# EAGLE design wm_1 (EAGLE 9.3.0)
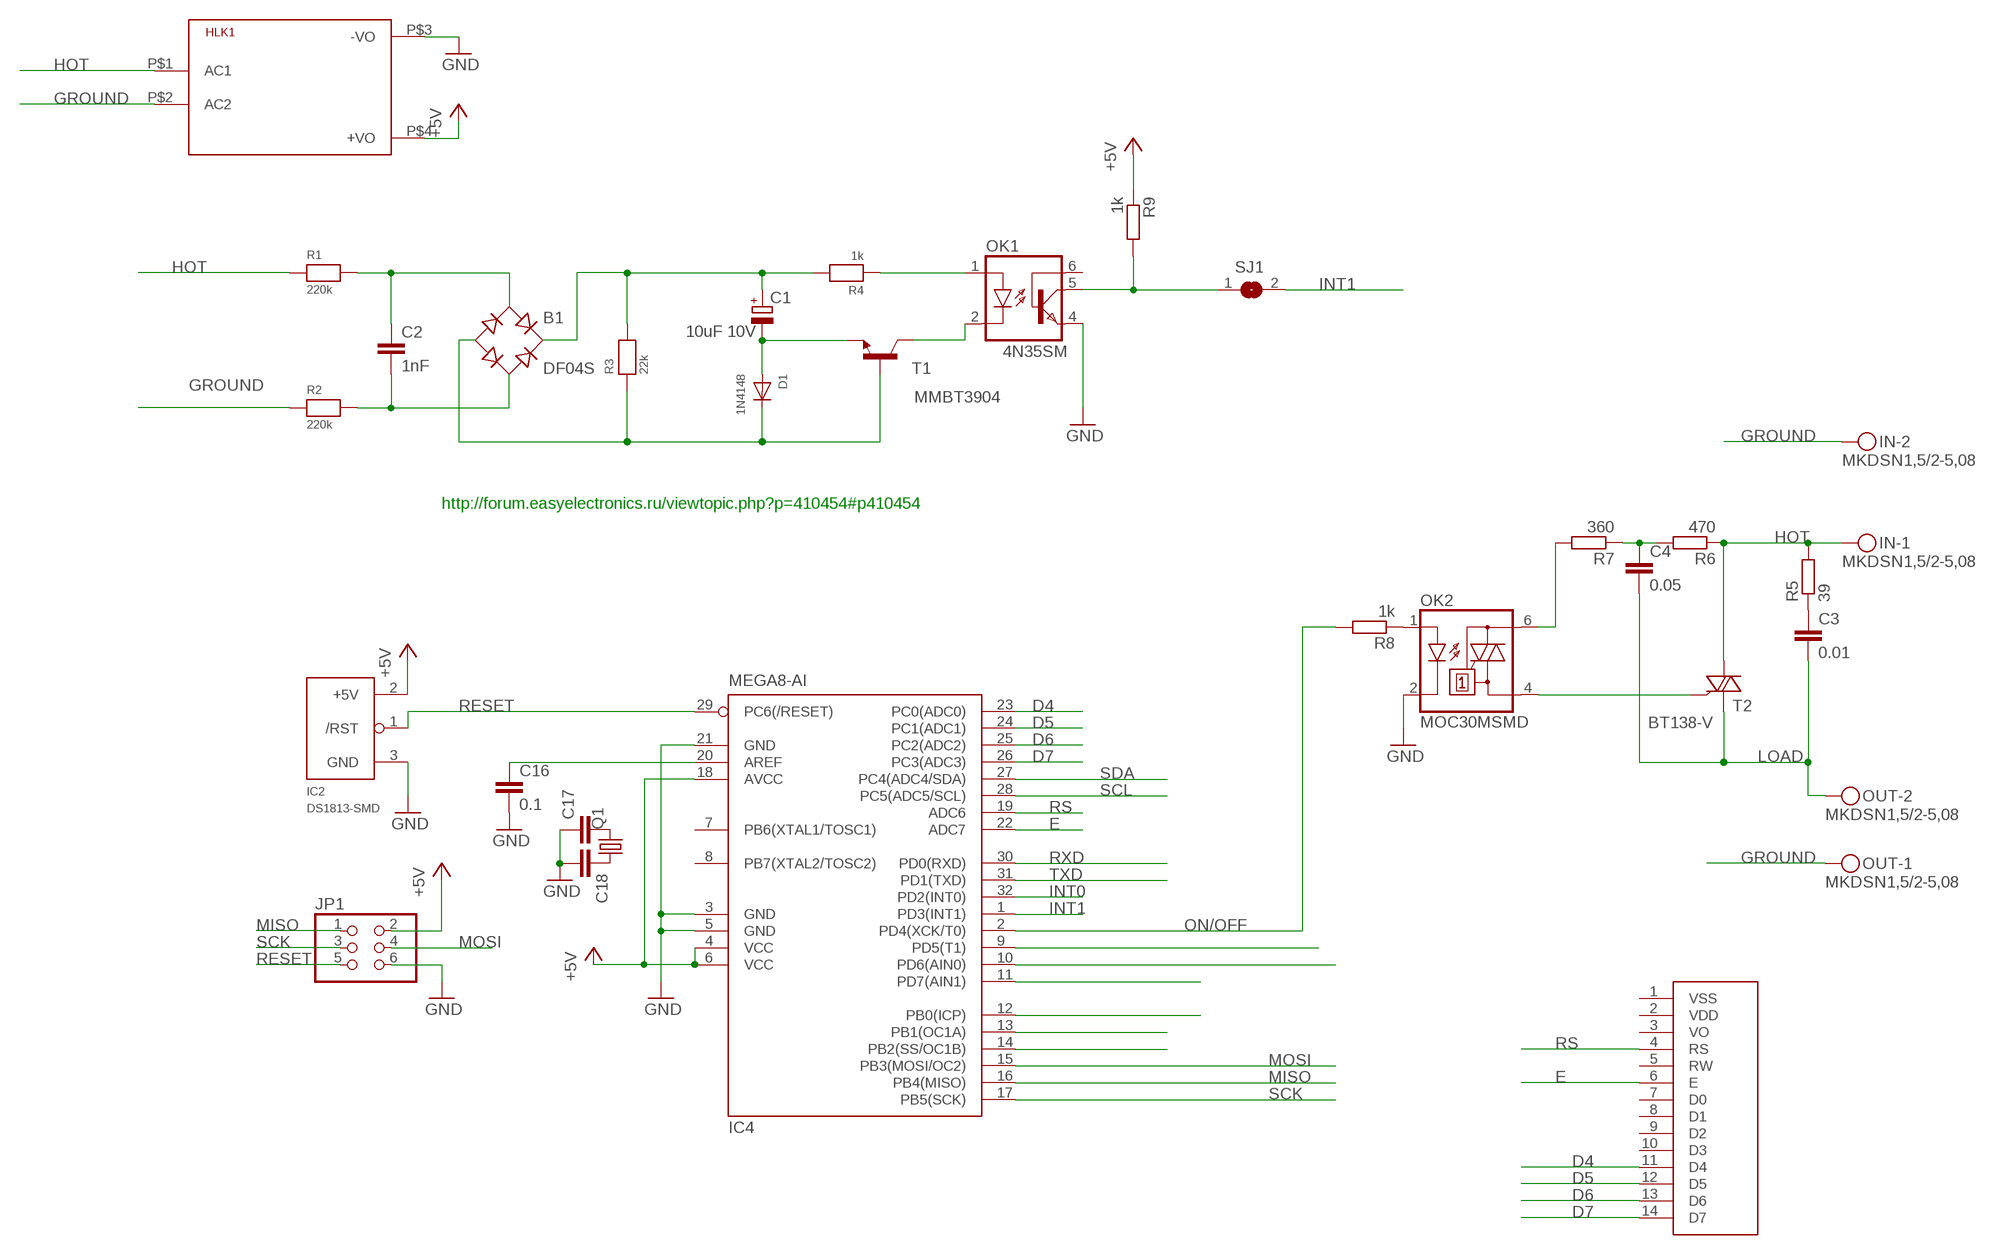
[diagram p0: schematic, sheet 1]

## Parts
B1  DF04S  [DFS]
C1  10uF 10V  CPOL-EU140CLH-1010  [140CLH-1010]
C2  1nF  C-EUC0805  [C0805]
C3  0.01  C-EUC1206  [C1206]
C4  0.05  C-EUC1206  [C1206]
C16  0.1  C-EUC0805  [C0805]
C17  C-EUC0805  [C0805]
C18  C-EUC0805  [C0805]
D1  1N4148  DIODESOD-123  [SOD-123]
HLK1  HLK-PM013W  [HLK-PM01]
IC2  DS1813-SMD  [SOT-23]
IC4  MEGA8-AI  [TQFP32-08]
IN  MKDSN1,5/2-5,08  [MKDSN1,5/2-5,08]
JP1  PINHD-2X3  [2X03]
OK1  4N35SM  [DIL6-SMD]
OK2  MOC30MSMD  [DIL6-SMD]
OUT  MKDSN1,5/2-5,08  [MKDSN1,5/2-5,08]
Q1  CRYSTALSM49  [SM49]
R1  220k  RESISTOR1206  [1206]
R2  220k  RESISTOR1206  [1206]
R3  22k  RESISTOR1206  [1206]
R4  1k  RESISTOR1206  [1206]
R5  39  R-EU_R1206  [R1206]
R6  470  R-EU_R1206  [R1206]
R7  360  R-EU_R1206  [R1206]
R8  1k  R-EU_R1206  [R1206]
R9  1k  R-EU_R1206  [R1206]
SJ1  SOLDERJUMPERREFLOW  [SOLDERJUMPER_REFLOW]
T1  MMBT3904  MMBT3904LT1-NPN-SOT23-BEC  [SOT23-BEC]
T2  BT138-V  [TO220BV]
U$1  2X16LCDSIDE  [2X16LCDSIDE]

## Nets
+5V: HLK1.P$4(+VO) IC2.2(+5V) IC4.4(VCC) IC4.6(VCC) IC4.18(AVCC) JP1.2 R9.1
D4: IC4.23(PC0(ADC0)) U$1.11(D4)
D5: IC4.24(PC1(ADC1)) U$1.12(D5)
D6: IC4.25(PC2(ADC2)) U$1.13(D6)
D7: IC4.26(PC3(ADC3)) U$1.14(D7)
E: IC4.22(ADC7) U$1.6(E)
E_RESET: IC4.13(PB1(OC1A))
E_SELECT: IC4.14(PB2(SS/OC1B))
GND: C16.2 C17.1 C18.2 HLK1.P$3(-VO) IC2.3(GND) IC4.3(GND) IC4.5(GND) IC4.21(GND) JP1.6 OK1.4(EMI) OK2.2(C)
GROUND: HLK1.P$2(AC2) IN.2 OUT.1 R2.1
HOT: HLK1.P$1(AC1) IN.1 R1.1 R5.2 R6.1 T2.T2(A2)
INT0: IC4.32(PD2(INT0))
INT1: IC4.1(PD3(INT1)) SJ1.2
LOAD: C3.2 C4.2 OUT.2 T2.T1(A1)
MISO: IC4.16(PB4(MISO)) JP1.1
MOSI: IC4.15(PB3(MOSI/OC2)) JP1.4
N$1: B1.AC1 C2.1 R1.2
N$2: B1.AC2 C2.2 R2.2
N$3: C1.- D1.A T1.E
N$4: B1.- D1.C R3.1 T1.B
N$5: B1.+ C1.+ R3.2 R4.2
N$6: OK1.1(A) R4.1
N$7: OK1.2(C) T1.C
N$8: C4.1 R6.2 R7.1
N$9: OK2.4(A1) T2.G
N$14: C18.1 Q1.1
N$15: C3.1 R5.1
N$16: OK2.6(A2) R7.2
N$17: OK2.1(A) R8.1
N$18: OK1.5(COL) R9.2 SJ1.1
N$26: C17.2 Q1.2
N$61: C16.1 IC4.20(AREF)
N$64: IC4.10(PD6(AIN0))
N$66: IC4.9(PD5(T1))
ON/OFF: IC4.2(PD4(XCK/T0)) R8.2
RESET: IC2.1(/RST) IC4.29(PC6(/RESET)) JP1.5
RS: IC4.19(ADC6) U$1.4(RS)
RXD: IC4.30(PD0(RXD))
SCK: IC4.17(PB5(SCK)) JP1.3
SCL: IC4.28(PC5(ADC5/SCL))
SD_DETECT: IC4.11(PD7(AIN1))
SD_SELECT: IC4.12(PB0(ICP))
SDA: IC4.27(PC4(ADC4/SDA))
TXD: IC4.31(PD1(TXD))
Unconnected: IC4.7(PB6(XTAL1/TOSC1)) IC4.8(PB7(XTAL2/TOSC2)) OK1.6(BAS) U$1.1(VSS) U$1.2(VDD) U$1.3(VO) U$1.5(RW) U$1.7(D0) U$1.8(D1) U$1.9(D2) U$1.10(D3)

## Notes on the sheet
- http://forum.easyelectronics.ru/viewtopic.php?p=410454#p410454

## Library data of the parts
B1 = rectifier:DF*S: Surface Mount Glass Passivated Bridge Rectifiers Source: Source: Comchip Bridge Rectifiers DF005S-G thru DF10S-G.pdf
C1 = rcl:CPOL-EU: POLARIZED CAPACITOR, European symbol; SPICEPREFIX: C
C2-C4 = rcl:C-EU: CAPACITOR, European symbol; SPICEPREFIX: C
C16-C18 = rcl:C-EU: CAPACITOR, European symbol
D1 = microbuilder:DIODE: Diode SMA Model Volts Amps Type Vf Vr Digikey # Notes SSA34-E3 40V 3A Schottky 480mV @ 3A 200uA @ 40V SSA34-E3/61TGITR-ND CDBA120-G 20V 1A Schottky 500mV @ 1A 500uA @ 20V 641-1014-6-ND REEL MBRA210 10V 2A Schottky 350mV @ 2A 700uA @ 10V MBRA210LT3 SOD-123 Model Volts Amps Type Vf Vr Order # Notes BAT54T1G 30V 200mA Schottky 800mV @ 200mA 2uA @ 25V BAT54T1GOSTR-ND B0530W 30V 500mA Schottky 430mV @ 500mA 130uA @ 30V B0530W-FDICT-ND REEL MBR120 1A 20V Schottky 340mV @ 1A MBR120VLSFT1GOSCT-ND SOD-323 Model Volts Amps Type Vf Vr Order # Notes PMEG2005EJ 20V 500mA Schottky 355mV @ 500mA 568-4110-1-ND ZLLS410 10V 570mA Schottky 380mV @ 570mA ZLLS410CT-ND 1N4148WS 75V 150mA Silicon/Simple 1V 1N4148WSFSCT-ND REEL SOD-523 Model Volts Amps Type Vf Vr Order # Notes BAT54XV2 30V 200mA Schottky 0.8V @ 100mA BAT54XV2CT-ND TB751S 30V 30mA Schottky RB751S-40TE61CT-ND SOT23-R/W (R = Solder Paste/Reflow Ovens, W = Hand-Soldering) Model Volts Amps Type Vf Vr Order # Notes BAT54FILM 40V 300mA Schottky 497-7162-1-ND
HLK1 = hi-link:HLK-PM01: Hi-Link Power Supply HLK-PM01 3W Author: Ahmed Said <https://github.com/AhmedSaid/EAGLELibraries>
IC2 = MyLib:DS1813
IC4 = atmel:MEGA8: MICROCONTROLLER 8 Kbytes FLASH, 1 kbytes SRAM, 512 bytes EEPROM, USART, 6-channel 10 bit ADC, 2-channel 8 bit ADC Pin compatible with Atmega48, ATMega88, ATMega168 Source: avr.lbr; MPN: ATMEGA8-16AU; OC_FARNELL: 9171371; OC_NEWARK: 73M8863
IN OUT = con-phoenix-508:MKDSN1,5/2-5,08: MKDSN 1,5/ 2-5,08 Printklemme Nennstrom: 13,5 A Nennspannung: 250 V Rastermaß: 5,08 mm Polzahl: 2 Anschlussart: Schraubanschluss Montage: Löten Anschlussrichtung Leiter/Platine: 0 ° Artikelnummer: 1729128 Source: http://eshop.phoenixcontact.com .. 1729128.pdf
JP1 = pinhead:PINHD-2X3: PIN HEADER
OK1 = optocoupler:4N*?M: General Purpose 6-Pin Phototransistor Optocouplers Source: http://www.fairchildsemi.com/ds/4N/4N35-M.pdf; MF: FAIRCHILD SEMICONDUCTOR; MPN: 4N35S-M; OC_FARNELL: 1021179; OC_NEWARK: 67K2285
OK2 = MyLib:MOC30*M: RANDOM-PHASE OPTOISOLATORS TRIAC DRIVER OUTPUT Source: http://www.fairchildsemi.com MOC3020-M.pdf
Q1 = crystal:CRYSTAL: CRYSTAL; OC_FARNELL: unknown; OC_NEWARK: unknown
R1-R4 = microbuilder:RESISTOR: Resistors 0402 - 0402 Surface Mount Package 22 Ohm 1% 1/16W [Digikey: 311-22.0LRTR-ND] 33 Ohm 5% 1/16W 1.0K 5% 1/16W 1.5K 5% 1/16W 2.0K 1% 1/16W 10.0K 1% 1/16W [Digikey: 311-10.0KLRTR-ND] 10.0K 5% 1/16W [Digikey: RMCF0402JT10K0TR-ND] 12.1K 1% 1/16W [Digikey: 311-22.0LRTR-ND] 100.0K 5% 1/16W 0603 - 0603 Surface Mount Package 0 Ohm 1/10 Watt 1% Resistor 15 Ohm 1/10 Watt 1% Resistor 33 Ohm 1/10 Watt 1% Resistor 49.9 Ohm 1/10 Watt 1% Resistor 100 Ohm 1/10 Watt 1% Resistor 150 Ohm 1/10 Watt 1% Resistor 240 Ohm 1/10 Watt 1% Resistor 390 Ohm 1/10 Watt 1% Resistor 560 Ohm 1/10 Watt 1% Resistor 680 Ohm 1/10 Watt 1% Resistor 750 Ohm 1/10 Watt 1% Resistor 1.0K Ohm 1/10 Watt 1% Resistor 1.5K Ohm 1/10 Watt 1% Resistor 2.0K Ohm 1/10 Watt 1% Resistor 2.2K Ohm 1/10 Watt 1% Resistor 3.3K Ohm 1/10 Watt 1% Resistor 4.7K Ohm 1/10 Watt 1% Resistor 10.0K Ohm 1/10 Watt 1% Resistor 12.0K Ohm 1/10 Watt 1% Resistor 12.1K Ohm 1/10 Watt 1% Resistor 20.0K Ohm 1/10 Watt 1% Resistor 33.0K Ohm 1/10 Watt 1% Resistor 100.0K Ohm 1/10 Watt 1% Resistor 0805 - 0805 Surface Mount Package 0 Ohm 1/8 Watt 1% Resistor 33 Ohm 1/8 Watt 1% Resistor 100 Ohm 1/8 Watt 1% Resistor 150 Ohm 1/8 Watt 1% Resistor 200 Ohm 1/8 Watt 1% Resistor 240 Ohm 1/8 Watt 1% Resistor 330 Ohm 1/8 Watt 1% Resistor 390 Ohm 1/8 Watt 1% Resistor 470 Ohm 1/8 Watt 1% Resistor 1.0K Ohm 1/8 Watt 1% Resistor 1.5K Ohm 1/8 Watt 1% Resistor 2.0K Ohm 1/8 Watt 1% Resistor 4.7K Ohm 1/8 Watt 1% Resistor 5.1K Ohm 1/8 Watt 1% Resistor 5.6K Ohm 1/8 Watt 1% Resistor 10.0K Ohm 1/8 Watt 1% Resistor 22.0K Ohm 1/8 Watt 1% Resistor 33.0K Ohm 1/8 Watt 1% Resistor 100K Ohm 1/8 Watt 1% Resistor 1206 - 1206 Surface Mount Package 2012 - 2010 Surface Mount Package 0.11 Ohm 1/2 Watt 1% Resistor - Digikey: RHM.11UCT-ND
R5-R9 = rcl:R-EU_: RESISTOR, European symbol; SPICEPREFIX: R
SJ1 = MyLib:SOLDERJUMPER: SMD Solder JUMPER Solder the two pads together to create a connection, or remove the solder to break it. REFLOW - Use this footprint for solder paste and reflow ovens. WAVE - Use this footprint for hand-soldering (larger pads). CLOSED - Has a trace between the two pads to ensure it is closed by default. The trace needs to be cut to disable the jumper, and can be closed again by creating a solder bridge between the two pads.
T1 = transistor:*-NPN-: NPN Transistror BF959 corrected 2008.03.06
T2 = MyLib:BT138: TRIAC Source: http://www.semiconductors.philips.com BT138_SERIES_2.pdf
U$1 = MyDisplays:2X16LCDSIDE

## Board
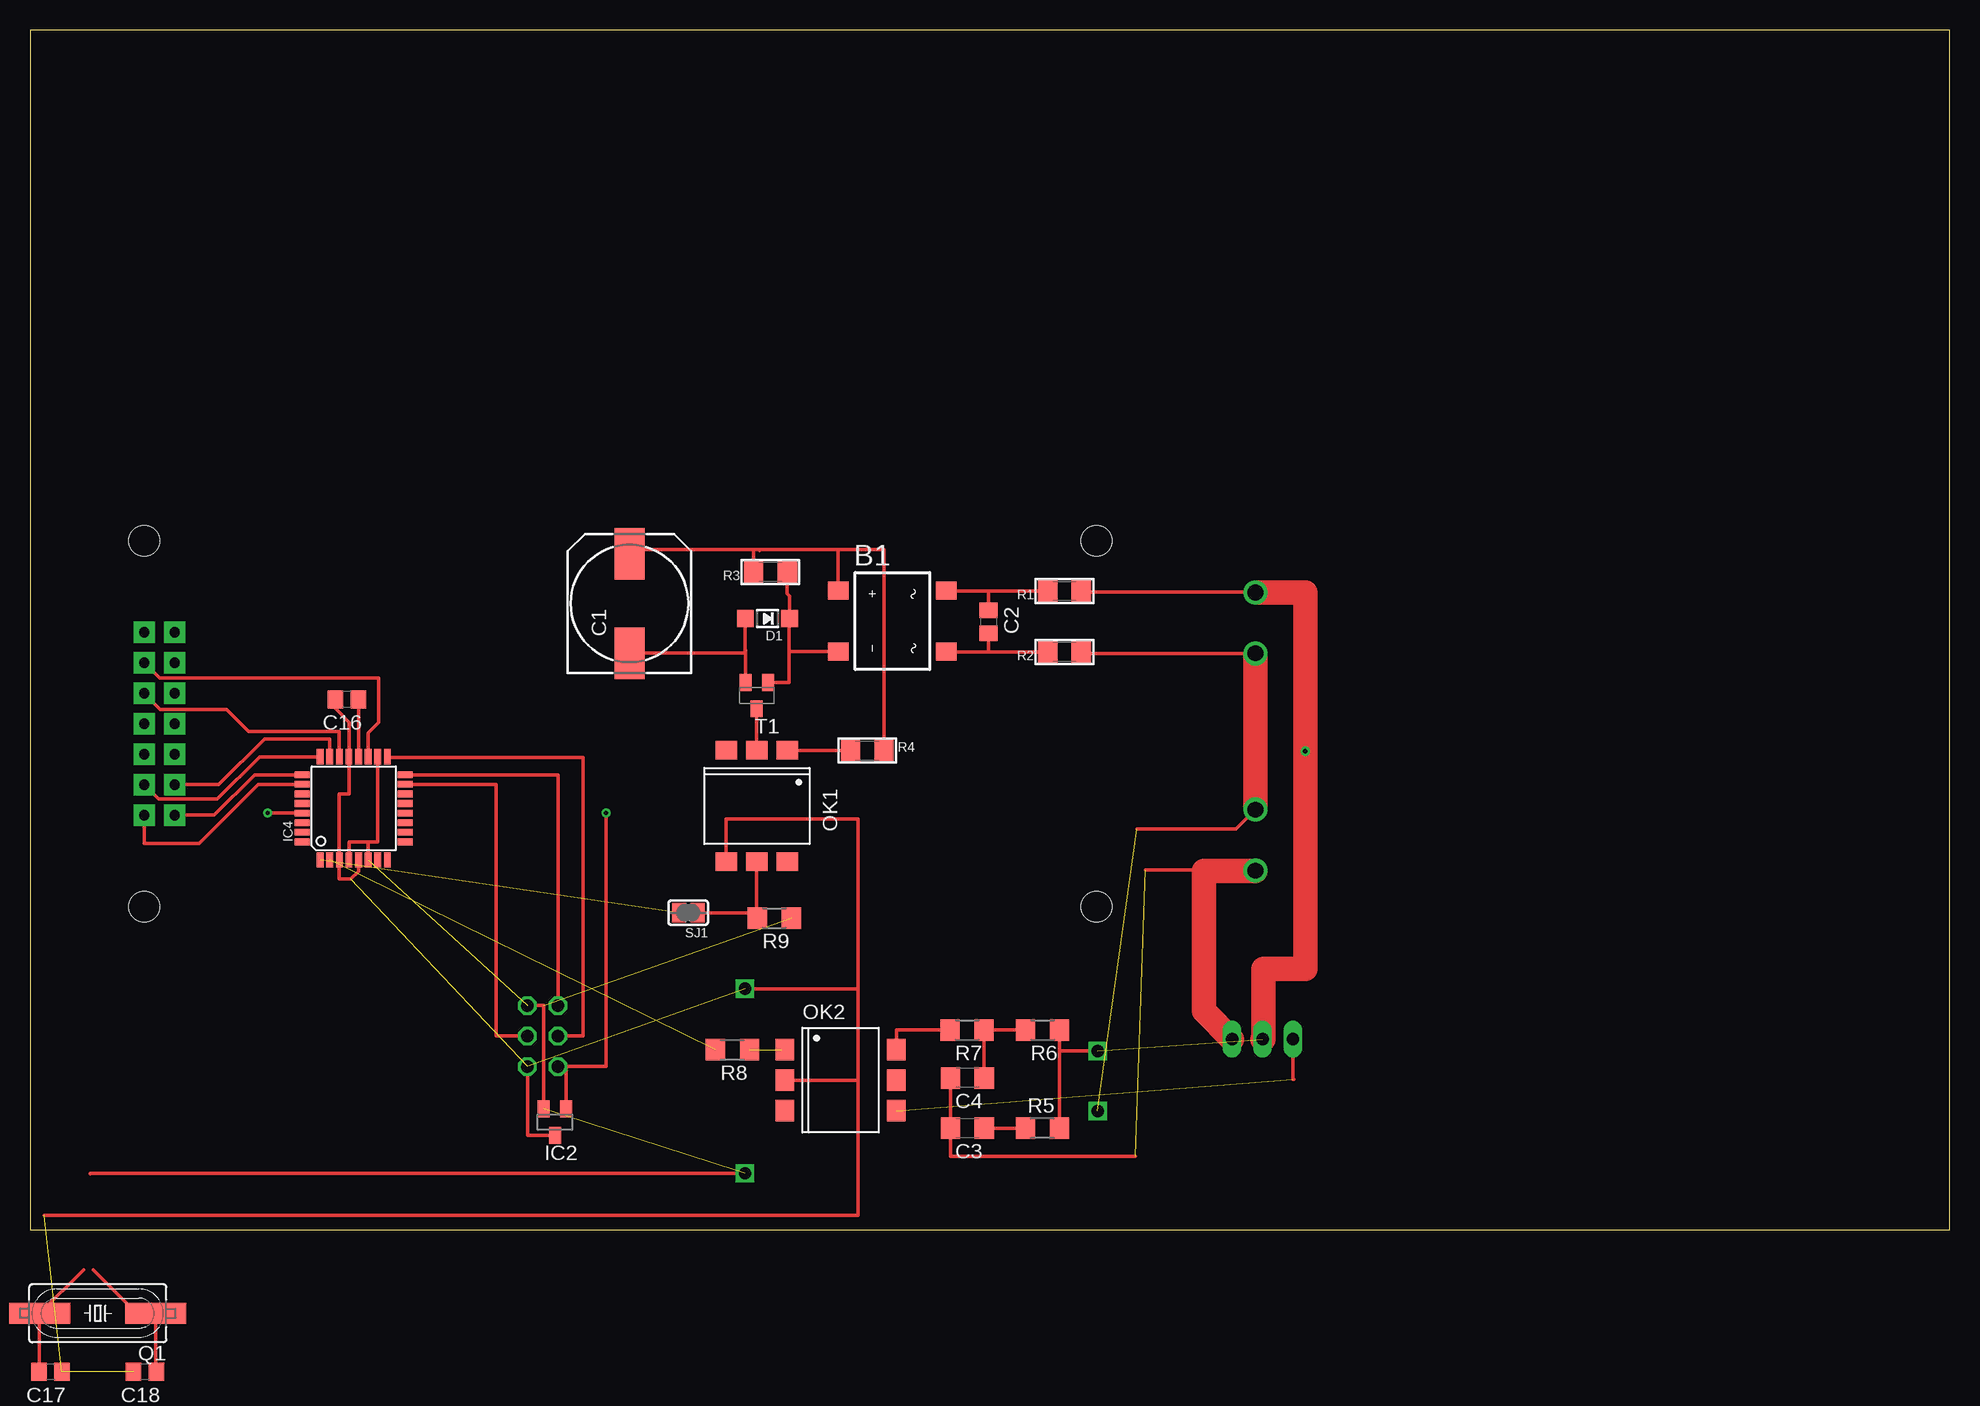
[diagram p1: board, top side]
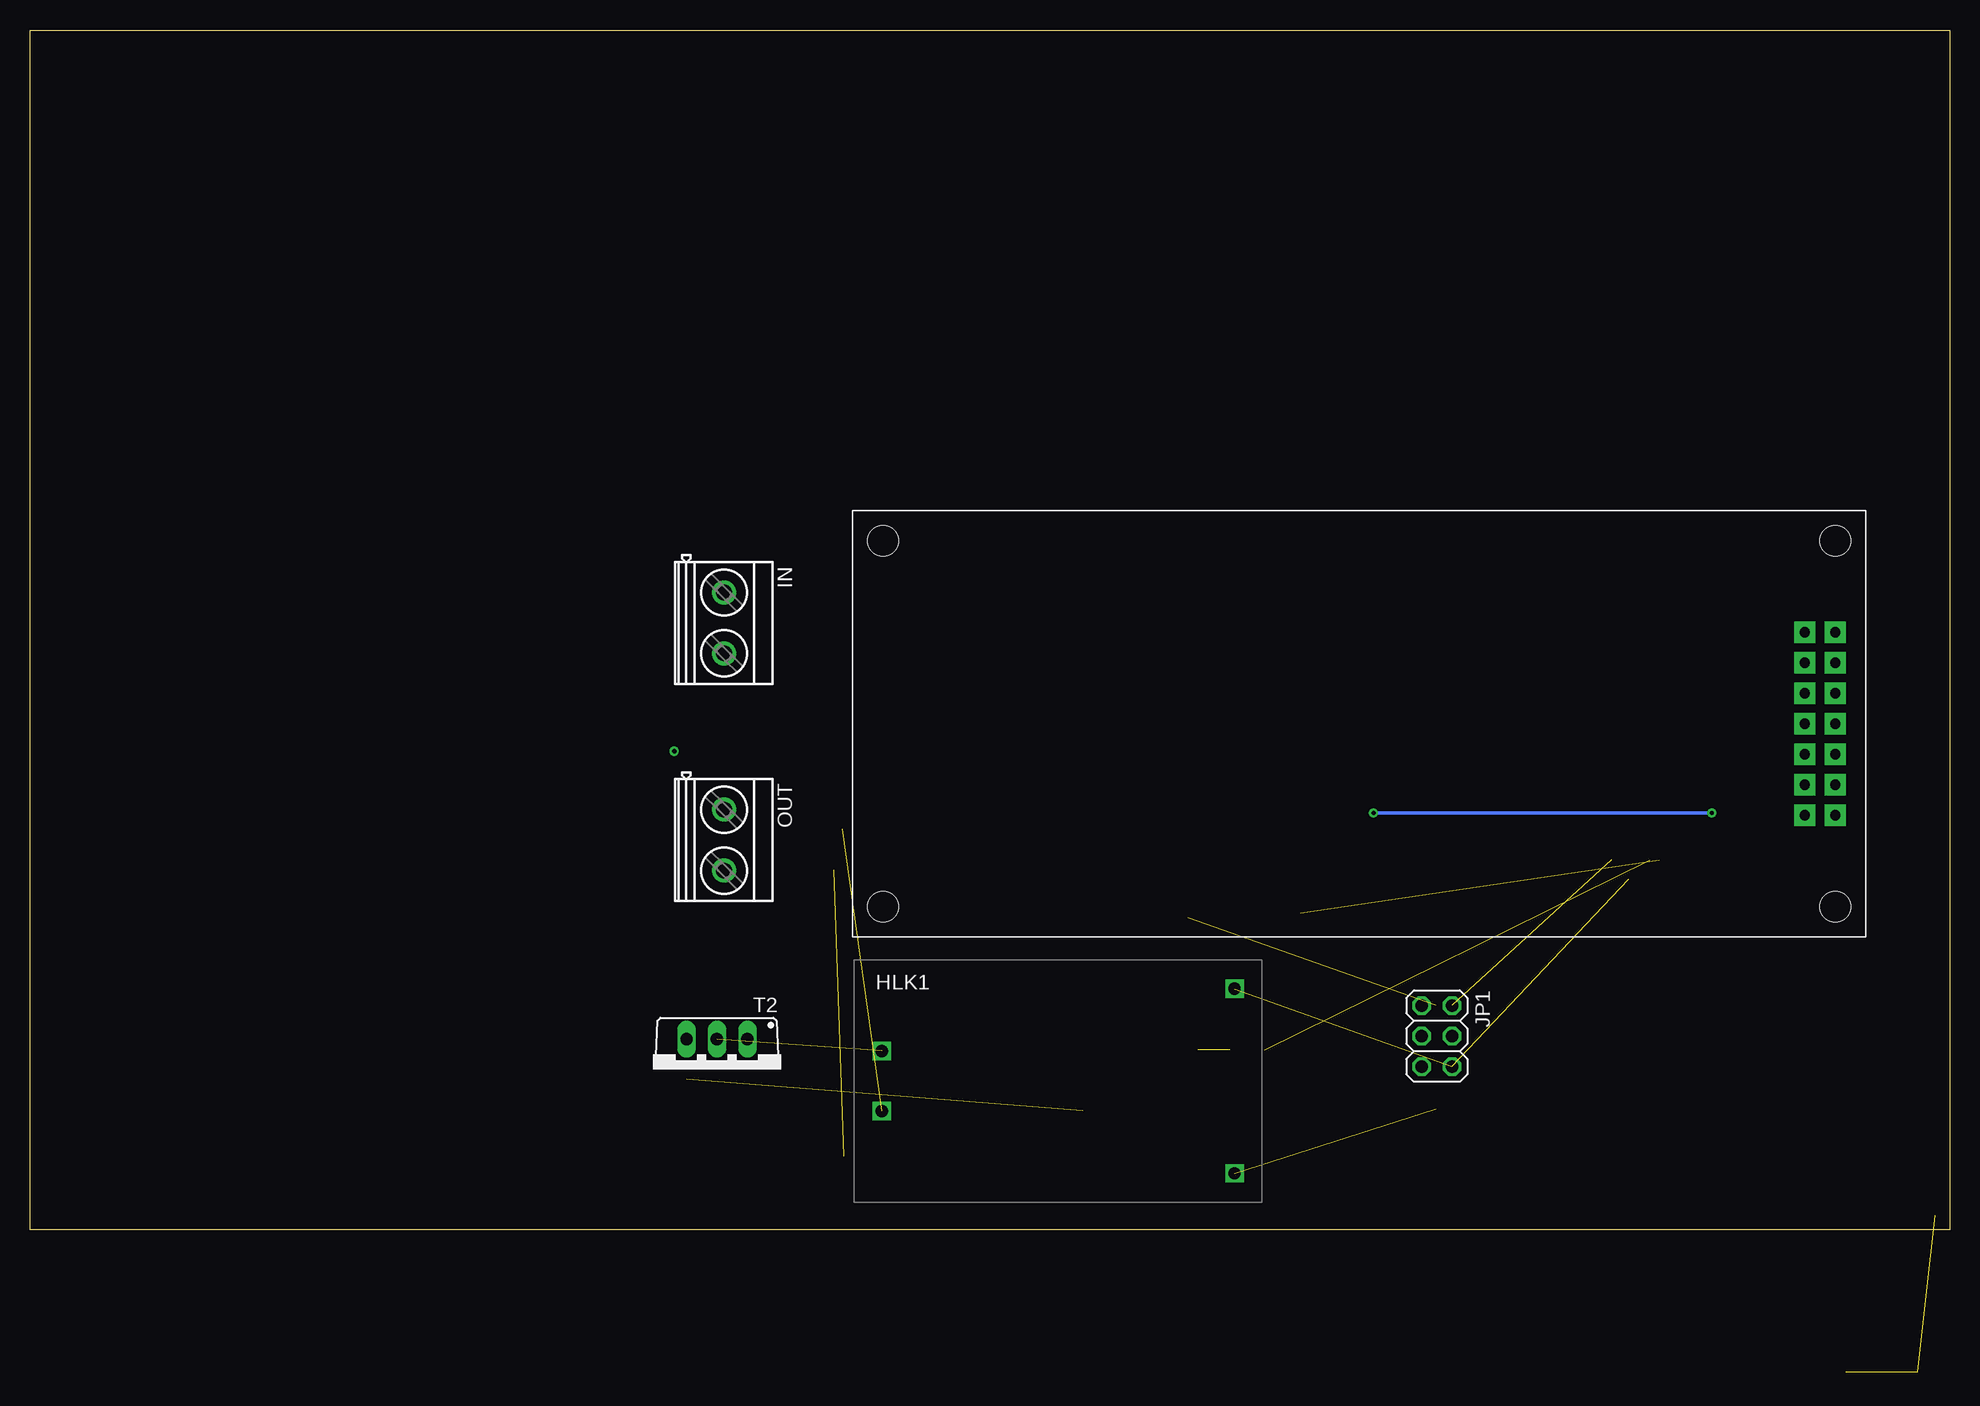
[diagram p2: board, bottom side, seen from below]

Size 160 x 100 mm. Coordinates in mm from the lower left corner, seen from the top.
Outline: 0,0 160,0 160,100 0,100 0,0
Copper layers (1*16): Top 0.035mm / dielectric 1.5mm / Bottom 0.035mm
Design rules "default": minimum track width 6mil, minimum drill 0.35mm, track to track 6mil, track to pad 6mil, pad to pad 6mil, via to via 6mil, smd to smd 6mil, copper to edge 40mil, drill to drill 6mil, minimum pad ring 10mil, minimum via ring 8mil, stop-mask expansion 4mil, vias tented up to drill 0mil, thermal gap 10mil

### Footprints (pad centres in the part's own frame; a part is rotated, then mirrored left to right if it is on the bottom)
DFS = smd 1.5 x 1.7: + -2.55,-4.5; - 2.55,-4.5; AC1 -2.55,4.5; AC2 2.55,4.5
140CLH-1010 = smd 4.3 x 2.5: + 4.15,0; - -4.15,0
C0805 = smd 1.3 x 1.5: 1 -0.95,0; 2 0.95,0
C1206 = smd 1.6 x 1.8: 1 -1.4,0; 2 1.4,0
SOD-123 = smd 1.4 x 1.4: A 1.85,0; C -1.85,0
HLK-PM01 = drill 1.016 square: P$1 -14.7,2.5; P$2 -14.7,-2.5; P$3 14.7,7.7; P$4 14.7,-7.7
SOT-23 = smd 1 x 1.4: 1 -0.95,-1.1; 2 0.95,-1.1; 3 0,1.1
TQFP32-08 = smd 1.27 x 0.559: 1 -4.293,2.8; 2 -4.293,2; 3 -4.293,1.2; 4 -4.293,0.4; 5 -4.293,-0.4; 6 -4.293,-1.2; 7 -4.293,-2; 8 -4.293,-2.8; 17 4.293,-2.8; 18 4.293,-2; 19 4.293,-1.2; 20 4.293,-0.4; 21 4.293,0.4; 22 4.293,1.2; 23 4.293,2; 24 4.293,2.8 | smd 0.559 x 1.27: 9 -2.8,-4.293; 10 -2,-4.293; 11 -1.2,-4.293; 12 -0.4,-4.293; 13 0.4,-4.293; 14 1.2,-4.293; 15 2,-4.293; 16 2.8,-4.293; 25 2.8,4.293; 26 2,4.293; 27 1.2,4.293; 28 0.4,4.293; 29 -0.4,4.293; 30 -1.2,4.293; 31 -2,4.293; 32 -2.8,4.293
MKDSN1,5/2-5,08 = drill 1.3 pad 2: 1 -2.561,0.025; 2 2.519,0.025
2X03 = drill 1.016 octagon: 1 -2.54,-1.27; 2 -2.54,1.27; 3 0,-1.27; 4 0,1.27; 5 2.54,-1.27; 6 2.54,1.27
DIL6-SMD = smd 1.78 x 1.52: 1 -2.54,-4.645; 2 0,-4.645; 3 2.54,-4.645; 4 2.54,4.645; 5 0,4.645; 6 -2.54,4.645
SM49 = smd 5.08 x 1.778: 1 -4.826,0; 2 4.826,0
1206 = smd 1.6 x 1.8: 1 -1.4,0; 2 1.4,0
R1206 = smd 1.6 x 1.803: 1 -1.422,0; 2 1.422,0
SOLDERJUMPER_REFLOW = smd 1.168 x 1.6: 1 -0.762,0; 2 0.762,0
SOT23-BEC = smd 1 x 1.4: B -0.95,-1.1; C 0,1.1; E 0.95,-1.1
TO220BV = drill 1.016 long: G 2.54,-2.54; T1 -2.54,-2.54; T2 0,-2.54
2X16LCDSIDE = drill 0.85 pad 1.778 square: 1 5.08,10.16; 2 2.54,10.16; 3 5.08,12.7; 4 2.54,12.7; 5 5.08,15.24; 6 2.54,15.24; 7 5.08,17.78; 8 2.54,17.78; 9 5.08,20.32; 10 2.54,20.32; 11 5.08,22.86; 12 2.54,22.86; 13 5.08,25.4; 14 2.54,25.4 | hole 2.54: 2.54,2.54; 2.54,33.02; 81.915,33.02; 81.915,2.54

### Placement (x,y rotation side)
B1  71.88,50.74 270 top
C1  49.97,52.2 90 top
C2  79.88,50.67 270 top
C3  78.14,8.45 180 top
C4  78.14,12.64 180 top
C16  26.42,44.2 180 top
C17  1.71,-11.87 180 top  (outside the outline)
C18  9.59,-11.87 180 top  (outside the outline)
D1  61.47,50.93 180 top
HLK1  74.3,12.38 0 bottom
IC2  43.75,8.95 180 top
IC4  26.99,35.12 90 top
IN  102.17,50.55 270 bottom
JP1  42.74,16.13 270 bottom
OK1  60.58,35.31 180 top
OK2  67.56,12.45 270 top
OUT  102.17,32.45 270 bottom
Q1  5.65,-6.99 180 top  (outside the outline)
R1  86.23,53.21 180 top
R2  86.23,48.13 180 top
R3  61.72,54.8 180 top
R4  69.79,39.94 0 top
R5  84.39,8.45 0 top
R6  84.39,16.64 180 top
R7  78.11,16.64 180 top
R8  58.55,14.99 180 top
R9  62.04,25.97 180 top
SJ1  54.86,26.42 180 top
T1  60.58,44.51 180 top
T2  102.74,13.34 180 bottom
U$1  6.99,59.94 180 bottom

### Tracks (layer width: path | path; a pad name or v marks a point on that pad's centre or on a via)
+5V  (3 unrouted)
  Top 0.305: IC4.6 28.19,32.32 | IC4.4 26.59,32.32 28.19,32.32 | IC2.2 42.8,18.67 JP1.2 | IC4.18 28.99,32.32 28.19,32.32 | HLK1.P$4 5.02,4.68 5.02,4.64
D4
  Top 0.305: U$1.11 15.75,37.08 19.56,40.89 24.99,40.89 IC4.23
D5
  Top 0.305: U$1.12 10.73,35.88 15.62,35.88 19.15,39.41 IC4.24
D6
  Top 0.305: IC4.25 18.74,37.92 15.37,34.54 U$1.13
D7
  Top 0.305: U$1.14 9.53,32.19 14.1,32.19 19.02,37.12 IC4.26
E
  Top 0.305: U$1.6 10.86,43.37 16.38,43.37 18.22,41.53 25.78,41.53 25.79,41.52 IC4.22
GND  (4 unrouted)
  Top 0.305: 26.61,39.41 26.61,36.32 25.79,36.32 IC4.3 25.79,29.21 26.73,29.21 27.39,29.86 IC4.5 | 26.61,39.41 IC4.21 | IC2.3 41.47,7.85 JP1.6 | C16.2 25.47,43.43 26.61,42.29 26.61,39.41 | HLK1.P$3 69.03,20.08 | 69.03,20.08 69.03,19.94 69.03,12.45 | 69.03,12.45 69.03,1.17 1.17,1.17 | OK2.2 69.03,12.45 | OK1.4 58.04,34.23 69.03,34.23 69.03,20.08
GROUND  (1 unrouted)
  Top 0.305: R2.1 87.63,48.03 IN.2 | 92.27,33.4 100.54,33.4 OUT.1
  Top 2.032: IN.2 OUT.1
HOT  (via drill 0.35)  (1 unrouted)
  Top 0.305: IN.1 102.15,53.15 87.7,53.15 R1.1 | R6.1 85.81,14.88 | 85.81,14.88 R5.2 | HLK1.P$1 85.81,14.88
  Top 2.032: IN.1 106.3,53.11 v106.3,39.88 106.3,21.72 102.81,21.72 102.81,15.88 T2.T2
  Bottom 0.305: 106.3,39.81 106.36,39.88 | 106.43,39.94 106.36,39.88 | 106.36,39.88 v106.3,39.88
INT1  (1 unrouted)
LOAD  (1 unrouted)
  Top 0.305: C4.2 C3.2 76.74,6.1 92.14,6.1 | 92.96,29.97 97.79,29.97 97.85,29.91
  Top 2.032: T2.T1 97.85,18.22 97.85,29.91 102.12,29.91 OUT.2
MISO
  Top 0.305: JP1.1 44.01,37.92 IC4.16
MOSI
  Top 0.305: IC4.15 38.86,37.12 38.86,16.13 JP1.4
N$1
  Top 0.305: 79.82,51.69 C2.1 79.88,53.09 80.01,53.21 | R1.2 80.01,53.21 | 80.01,53.21 76.46,53.21 B1.AC1
N$2
  Top 0.305: R2.2 79.82,48.13 | 79.82,48.13 76.44,48.13 B1.AC2 | C2.2 79.88,48.2 79.82,48.13
N$3
  Top 0.305: D1.A 59.62,48.16 | 59.62,48.16 59.63,48.15 59.63,48.3 | 59.56,48.16 59.62,48.16 | 59.62,48.16 59.62,48.05 | C1.- 59.62,48.05 | 59.62,48.05 59.63,48.05 T1.E
N$4
  Top 0.305: 63.31,50.92 D1.C | R3.1 63.12,53.02 63.31,52.83 63.31,51.12 | 63.31,51.12 63.31,50.92 | 63.31,50.92 63.24,50.85 | 63.29,48.19 63.29,51.12 63.31,51.12 | B1.- 63.29,48.19 | 63.29,48.19 63.29,48.13 63.29,45.61 T1.B
N$5
  Top 0.305: 60.32,54.82 R3.2 | R3.2 60.32,56.71 | 60.32,56.71 60.83,56.71 | 60.83,56.71 67.37,56.71 | 67.37,56.71 B1.+ | 60.32,54.74 R3.2 | 67.37,56.71 71.18,56.71 71.18,44.13 71.19,44.13 R4.2 | 60.83,56.6 60.83,56.71 | C1.+ 49.97,56.71 60.32,56.71
N$6
  Top 0.305: R4.1 OK1.1
N$7
  Top 0.305: OK1.2 T1.C
N$8
  Top 0.305: R6.2 R7.1 C4.1
N$9  (1 unrouted)
  Top 0.305: 105.35,12.51 105.28,12.51 T2.G
N$14
  Top 0.305: 5.28,-3.37 8.89,-6.99 Q1.1 10.48,-11.81 C18.1
N$15
  Top 0.305: C3.1 R5.1
N$16
  Top 0.305: OK2.6 72.21,16.64 R7.2
N$17  (1 unrouted)
  Top 0.305: 62.64,14.99 OK2.1
N$18
  Top 0.305: SJ1.1 60.62,26.42 60.62,26.23 | 60.62,26.23 R9.2 | OK1.5 60.58,26.23 60.62,26.23
N$26
  Top 0.305: Q1.2 0.83,-6.92 | 4.48,-3.33 Q1.2 | C17.2 0.76,-7.05 Q1.2
N$61
  Top 0.305: IC4.20 27.39,44.2 C16.1
ON/OFF  (1 unrouted)
RESET  (via drill 0.35)
  Top 0.305: IC2.1 44.7,13.59 JP1.5 48.01,13.59 v48.01,34.73 | v19.81,34.73 22.7,34.73 IC4.29
  Bottom 0.305: v48.01,34.73 v19.81,34.73
RS
  Top 0.305: U$1.4 10.79,45.97 29.08,45.97 29.08,42.29 28.19,41.4 IC4.19
SCK
  Top 0.305: JP1.3 46.1,16.13 46.1,39.37 29.79,39.37 IC4.17